# EAGLE design AstroEQ SMD MK2 (EQ5) (EAGLE 6.6.0)
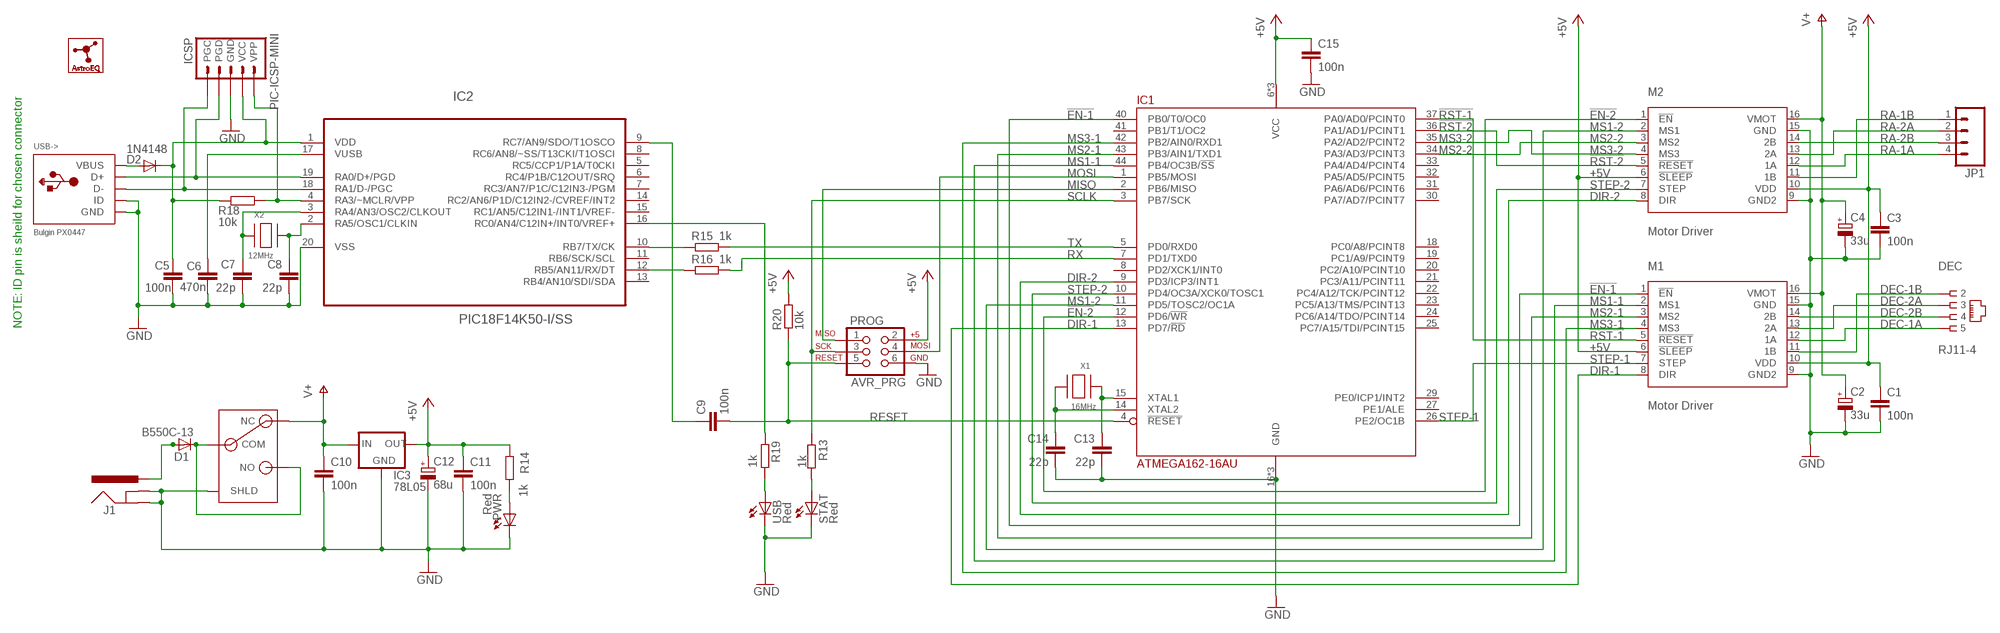
[diagram p0: schematic, sheet 1]

## Parts
C1  100n  C-EUC0603  [C0603]
C2  33u  CPOL-EUC/6032-28R  [C/6032-28R]
C3  100n  C-EUC0603  [C0603]
C4  33u  CPOL-EUC/6032-28R  [C/6032-28R]
C5  100n  C-EUC0603  [C0603]
C6  470n  C-EUC0603  [C0603]
C7  22p  C-EUC0603  [C0603]
C8  22p  C-EUC0603  [C0603]
C9  100n  C-EUC0603  [C0603]
C10  100n  C-EUC0603  [C0603]
C11  100n  C-EUC0603  [C0603]
C12  68u  CPOL-EUC/6032-28R  [C/6032-28R]
C13  22p  C-EUC0603  [C0603]
C14  22p  C-EUC0603  [C0603]
C15  100n  C-EUC0603  [C0603]
D1  B550C-13  DIODE-SMC  [SMC]
D2  1N4148  DIODESOD  [SOD-323]
DEC  RJ11-4  [RJ11-NO_SHIELD-4]
IC1  ATMEGA162-16AU  [TQFP44]
IC2  PIC18F14K50-I/SS  [SS20]
IC3  78L05  78LXXSOT-23  [SOT23]
ICSP  PIC-ICSP-MINI  [PIC-ICSP-MINI]
J1  POWER_JACKPANEL  [POWER_JACK_PANEL]
JP1  M04POLAR  [MOLEX-1X4]
LOGO1  ASTROEQ5MM  [ASTROEQ-SMALL]
M1  Motor Driver  A4983CARRIER  [DIP16-W]
M2  Motor Driver  A4983CARRIER  [DIP16-W]
PROG  AVR_PRG  AVR_SPI_PRG_6PTH  [2X3]
PWR  Red  LED3MM  [LED3MM]
R13  1k  R-EU_R0603  [R0603]
R14  1k  R-EU_R0603  [R0603]
R15  1k  R-EU_R0603  [R0603]
R16  1k  R-EU_R0603  [R0603]
R18  10k  R-EU_R0603  [R0603]
R19  1k  R-EU_R0603  [R0603]
R20  10k  R-EU_R0603  [R0603]
STAT  Red  LED3MM  [LED3MM]
SW1  SWITCH  [SPST]
USB  Red  LED3MM  [LED3MM]
USB->  Bulgin PX0447  USBBULGIN  [USB-MINIB-BULGIN]
X1  16MHz  XTALNX5032  [NX5032]
X2  12MHz  XTALNX5032  [NX5032]

## Nets
!EN-1: IC1.40(PB0/T0/OC0) M1.1(!EN)
!EN-2: IC1.12(PD6/!WR) M2.1(!EN)
!RST-1: IC1.37(PA0/AD0/PCINT0) M1.5(!RESET)
!RST-2: IC1.36(PA1/AD1/PCINT1) M2.5(!RESET)
+5V: C1.1 C3.1 C11.1 C12.+ C15.1 IC1.6(VCC) IC1.17(VCC) IC1.38(VCC) IC3.1(OUT) M1.6(!SLEEP) M1.10(VDD) M2.6(!SLEEP) M2.10(VDD) PROG.2 R14.1 R20.2
AVROSC1: C13.1 IC1.15(XTAL1) X1.P$1
AVROSC2: C14.1 IC1.14(XTAL2) X1.P$2
D+: IC2.19(RA0/D+/PGD) ICSP.4(PGD) USB->.3(D+)
D-: IC2.18(RA1/D-/PGC) ICSP.5(PGC) USB->.2(D-)
DEC-1A: DEC.5 M1.12(1A)
DEC-1B: DEC.2 M1.11(1B)
DEC-2A: DEC.3 M1.13(2A)
DEC-2B: DEC.4 M1.14(2B)
DIR-1: IC1.13(PD7/!RD) M1.8(DIR)
DIR-2: IC1.9(PD3/ICP3/INT1) M2.8(DIR)
DTR: C9.1 IC2.9(RC7/AN9/SDO/T1OSCO)
GND: C1.2 C2.- C3.2 C4.- C5.2 C6.1 C7.2 C8.2 C10.2 C11.2 C12.- C13.2 C14.2 C15.2 IC1.16(GND) IC1.28(GND) IC1.39(GND) IC2.20(VSS) IC3.3(GND) ICSP.3(GND) J1.SHUNT(GNDBREAK) J1.SLEEVE(GND) M1.9(GND2) M1.15(GND) M2.9(GND2) M2.15(GND) PROG.6 PWR.K(C) STAT.K(C) SW1.S1(SHLD) SW1.S2(SHLD) SW1.S3(SHLD) SW1.S4(SHLD) USB->.4(GND) USB->.5(ID) USB.K(C)
MCLR: IC2.4(RA3/~MCLR/VPP) ICSP.1(VPP) R18.1
MISO: IC1.2(PB6/MISO) PROG.1
MOSI: IC1.1(PB5/MOSI) PROG.4
MS1-1: IC1.44(PB4/OC3B/!SS) M1.2(MS1)
MS1-2: IC1.11(PD5/TOSC2/OC1A) M2.2(MS1)
MS2-1: IC1.43(PB3/AIN1/TXD1) M1.3(MS2)
MS2-2: IC1.34(PA3/AD3/PCINT3) M2.3(MS2)
MS3-1: IC1.42(PB2/AIN0/RXD1) M1.4(MS3)
MS3-2: IC1.35(PA2/AD2/PCINT2) M2.4(MS3)
PWRLED: PWR.A R14.2
RA-1A: JP1.4 M2.12(1A)
RA-1B: JP1.1 M2.11(1B)
RA-2A: JP1.2 M2.13(2A)
RA-2B: JP1.3 M2.14(2B)
RESET: C9.2 IC1.4(!RESET) PROG.5 R20.1
RX: IC1.7(PD1/TXD0) R16.1
RX(USB): IC2.12(RB5/AN11/RX/DT) R16.2
SCLK: IC1.3(PB7/SCK) PROG.3 R13.1
STATLED: R13.2 STAT.A
STEP-1: IC1.26(PE2/OC1B) M1.7(STEP)
STEP-2: IC1.10(PD4/OC3A/XCK0/TOSC1) M2.7(STEP)
SWITCH: D1.C SW1.COM SW1.NO
TX: IC1.5(PD0/RXD0) R15.1
TX(USB): IC2.10(RB7/TX/CK) R15.2
USBLED: R19.1 USB.A
USBOSC1: C8.1 IC2.2(RA5/OSC1/CLKIN) X2.P$2
USBOSC2: C7.1 IC2.3(RA4/AN3/OSC2/CLKOUT) X2.P$1
USBSTAT: IC2.16(RC0/AN4/C12IN+/INT0/VREF+) R19.2
V+: C2.+ C4.+ C10.1 IC3.2(IN) M1.16(VMOT) M2.16(VMOT) SW1.NC
VBUS: D2.2(A) USB->.1(VBUS)
VIN: D1.A J1.CENTRE(PWR)
VPIC: C5.1 D2.1(C) IC2.1(VDD) ICSP.2(VCC) R18.2
VUSB: C6.2 IC2.17(VUSB)
Unconnected: IC1.8(PD2/XCK1/INT0) IC1.18(PC0/A8/PCINT8) IC1.19(PC1/A9/PCINT9) IC1.20(PC2/A10/PCINT10) IC1.21(PC3/A11/PCINT11) IC1.22(PC4/A12/TCK/PCINT12) IC1.23(PC5/A13/TMS/PCINT13) IC1.24(PC6/A14/TDO/PCINT14) IC1.25(PC7/A15/TDI/PCINT15) IC1.27(PE1/ALE) IC1.29(PE0/ICP1/INT2) IC1.30(PA7/AD7/PCINT7) IC1.31(PA6/AD6/PCINT6) IC1.32(PA5/AD5/PCINT5) IC1.33(PA4/AD4/PCINT4) IC1.41(PB1/T1/OC2) IC2.5(RC5/CCP1/P1A/T0CKI) IC2.6(RC4/P1B/C12OUT/SRQ) IC2.7(RC3/AN7/P1C/C12IN3-/PGM) IC2.8(RC6/AN8/~SS/T13CKI/T1OSCI) IC2.11(RB6/SCK/SCL) IC2.13(RB4/AN10/SDI/SDA) IC2.14(RC2/AN6/P1D/C12IN2-/CVREF/INT2) IC2.15(RC1/AN5/C12IN1-/INT1/VREF-)

## Notes on the sheet
- NOTE: ID pin is sheild for chosen connector

## Library data of the parts
C1 C3 C5 C9-C11 C15 = resistor:C-EU: CAPACITOR, European symbol; MF: MULTICOMP; MPN: T0603F104ZCT; OC_FARNELL: 9406204
C2 C4 = resistor:CPOL-EU: POLARIZED CAPACITOR, European symbol; MF: KEMET; MPN: T491C336K025AT; OC_FARNELL: 1793896
C6 = rcl:C-EU: CAPACITOR, European symbol; MF: MURATA; MPN: GRM188R61C474KA93D; OC_FARNELL: 1828894
C7 C8 C13 C14 = rcl:C-EU: CAPACITOR, European symbol; MF: MULTICOMP; MPN: U0603C220JCT; OC_FARNELL: 9406107
C12 = resistor:CPOL-EU: POLARIZED CAPACITOR, European symbol; MF: AVX; MPN: TPSC686K016R0125; OC_FARNELL: 1658976
D1 = diode:DIODE-: DIODE; MF: DIODES INC.; MPN: B550C-13-F; OC_FARNELL: 1858608
D2 = SparkFun:DIODE: Diode These are standard reverse protection diodes and small signal diodes. SMA package can handle up to about 1A. SOD-323 can handle about 200mA. What the SOD-323 package when ordering, there are some mfgs out there that are 5-pin packages.; MF: VISHAY SEMICONDUCTOR; MPN: 1N4148WS-V-GS08; OC_FARNELL: 1617737
DEC = con-tycoelectronics:RJ11-4; MF: MOLEX; MPN: 95503-2641; OC_FARNELL: 1572017
IC1 = atmel:ATMEGA162: 8-bit RISC MICROCONTROLLER 16K Bytes internal flash program memory 1K Bytes internal SRAM Upto 64K Bytes optional external memory space 512 Bytes EEPROM Two 8-bit timers Two 16-bit timers Dual programmable serial USARTs Master/Slave serial SPI interface Source: ATMEGA162_DIP40.lbr; MF: ATMEL; MPN: ATMEGA162-16AU; OC_FARNELL: 9171150
IC2 = microchip:PIC18F14K50: USB Flash Microcontrollers; MF: MICROCHIP; MPN: PIC18F14K50-I/SS; OC_FARNELL: 1648504; PACKAGE: SSOP20; SUPPLIER: Microchip
IC3 = v-reg:78LXX: VOLTAGE REGULATOR; MF: TAIWAN SEMICONDUCTOR; MPN: TS78L05CX RF; OC_FARNELL: 1476698
ICSP = SparkFun:PIC-ICSP-MINI: PIC-ICSP-Mini Miniature 5-pin connection for temporary programming of PICs. Use this device in your design to save space. Program the PIC with this adapter Spark Fun Electronics SKU : BOB-00194; MF: HARWIN; MPN: M52-5000545; OC_FARNELL: 1099543
J1 = SparkFun:POWER_JACK: Power Jack This is the standard 5.5mm barrel jack for power. The PTH is the most common, proven, reliable, footprint. All others are experimental. The Slot footprint only works if the mill layer is transmitted to the PCB fab house so be warned. Spark Fun Electronics SKU : PRT-00119. Mating wall wart : TOL-00298 (and others); MF: SWITCHCRAFT; MPN: PCL712AS; OC_FARNELL: 1871167
JP1 = SparkFun:M04: Header 4 Standard 4-pin 0.1" header. Use with straight break away headers (SKU : PRT-00116), right angle break away headers (PRT-00553), swiss pins (PRT-00743), machine pins (PRT-00117), and female headers (PRT-00115). Molex polarized connector foot print use with SKU : PRT-08231 with associated crimp pins and housings. 1MM SMD Version SKU: PRT-10208; MF: MULTICOMP; MPN: MC34645; OC_FARNELL: 1675775
LOGO1 = AstroEQTooth:ASTROEQ
M1 M2 = A4983Carrier:A4983CARRIER; OC_FARNELL: unknown
PROG = SparkFun:AVR_SPI_PRG_6: AVR ISP 6 Pin This is the reduced ISP connector for AVR programming. Common on Arduino. This footprint will take up less PCB space and can be used with a 10-pin to 6-pin adapter such as SKU: BOB-08508; MF: TE CONNECTIVITY / AMP; MPN: 826632-3; OC_FARNELL: 3418492
PWR STAT USB = led:LED: LED OSRAM: - CHIPLED LG R971, LG N971, LY N971, LG Q971, LY Q971, LO R971, LY R971 LH N974, LH R974 LS Q976, LO Q976, LY Q976 LO Q996 - Hyper CHIPLED LW Q18S LB Q993, LB Q99A, LB R99A - SideLED LS A670, LO A670, LY A670, LG A670, LP A670 LB A673, LV A673, LT A673, LW A673 LH A674 LY A675 LS A676, LA A676, LO A676, LY A676, LW A676 LS A679, LY A679, LG A679 - Hyper Micro SIDELED® LS Y876, LA Y876, LO Y876, LY Y876 LT Y87S - SmartLED LW L88C, LW L88S LB L89C, LB L89S, LG L890 LS L89K, LO L89K, LY L89K LS L896, LA L896, LO L896, LY L896 - TOPLED LS T670, LO T670, LY T670, LG T670, LP T670 LSG T670, LSP T670, LSY T670, LOP T670, LYG T670 LG T671, LOG T671, LSG T671 LB T673, LV T673, LT T673, LW T673 LH T674 LS T676, LA T676, LO T676, LY T676, LB T676, LH T676, LSB T676, LW T676 LB T67C, LV T67C, LT T67C, LS T67K, LO T67K, LY T67K, LW E67C LS E67B, LA E67B, LO E67B, LY E67B, LB E67C, LV E67C, LT E67C LW T67C LS T679, LY T679, LG T679 LS T770, LO T770, LY T770, LG T770, LP T770 LB T773, LV T773, LT T773, LW T773 LH T774 LS E675, LA E675, LY E675, LS T675 LS T776, LA T776, LO T776, LY T776, LB T776 LHGB T686 LT T68C, LB T68C - Hyper Mini TOPLED® LB M676 - Mini TOPLED Santana® LG M470 LS M47K, LO M47K, LY M47K Source: http://www.osram.convergy.de LUXEON: - LUMILED® LXK2-PW12-R00, LXK2-PW12-S00, LXK2-PW14-U00, LXK2-PW14-V00 LXK2-PM12-R00, LXK2-PM12-S00, LXK2-PM14-U00 LXK2-PE12-Q00, LXK2-PE12-R00, LXK2-PE12-S00, LXK2-PE14-T00, LXK2-PE14-U00 LXK2-PB12-K00, LXK2-PB12-L00, LXK2-PB12-M00, LXK2-PB14-N00, LXK2-PB14-P00, LXK2-PB14-Q00 LXK2-PR12-L00, LXK2-PR12-M00, LXK2-PR14-Q00, LXK2-PR14-R00 LXK2-PD12-Q00, LXK2-PD12-R00, LXK2-PD12-S00 LXK2-PH12-R00, LXK2-PH12-S00 LXK2-PL12-P00, LXK2-PL12-Q00, LXK2-PL12-R00 Source: www.luxeon.com KINGBRIGHT: KA-3528ASYC Source: www.kingbright.com; MF: KINGBRIGHT; MPN: L-424HDT; OC_FARNELL: 1142499
R13 R14 R19 = rcl:R-EU_: RESISTOR, European symbol; MF: PANASONIC; MPN: ERJ3GEYJ102V; OC_FARNELL: 2059601
R15 R16 = SmartPrj:R-EU_: RESISTOR, European symbol; MF: PANASONIC; MPN: ERJ3GEYJ102V; OC_FARNELL: 2059601
R18 R20 = rcl:R-EU_: RESISTOR, European symbol; MF: PANASONIC; MPN: ERJ3GEYJ103V; OC_FARNELL: 2059627
SW1 = con-tycoelectronics:SWITCH; MF: TE CONNECTIVITY; MPN: AE101J1V3B004; OC_FARNELL: 1813654
USB-> = adafruit:USB: USB Connectors USBMINIB - Surface Mount Female Mini-B USB Connector 4UConnector: 06564 By microbuilder.eu Thru-hole RA Female Mini-B USB Connector 4UConnector: 18732 By ladyada.net; MF: BULGIN; MPN: PX0447; OC_FARNELL: 1229687
X1 = adafruit:XTAL: Low cost SMT crystals, no capacitors included http://www.ladyada.net/library/eagle; MF: TXC; MPN: 7A-16.000MAAJ-T; OC_FARNELL: 1841946
X2 = adafruit:XTAL: Low cost SMT crystals, no capacitors included http://www.ladyada.net/library/eagle; MF: TXC; MPN: 7A-12.000MAAJ-T; OC_FARNELL: 1841940

## Net classes
1 power: width 0.61 mm, drill 0.711 mm, clearance 0.203 mm
2 gnd: width 0.305 mm, drill 0.711 mm, clearance 0.203 mm
3 usbvcc: width 0.508 mm, drill 0.711 mm, clearance 0.203 mm

## Board
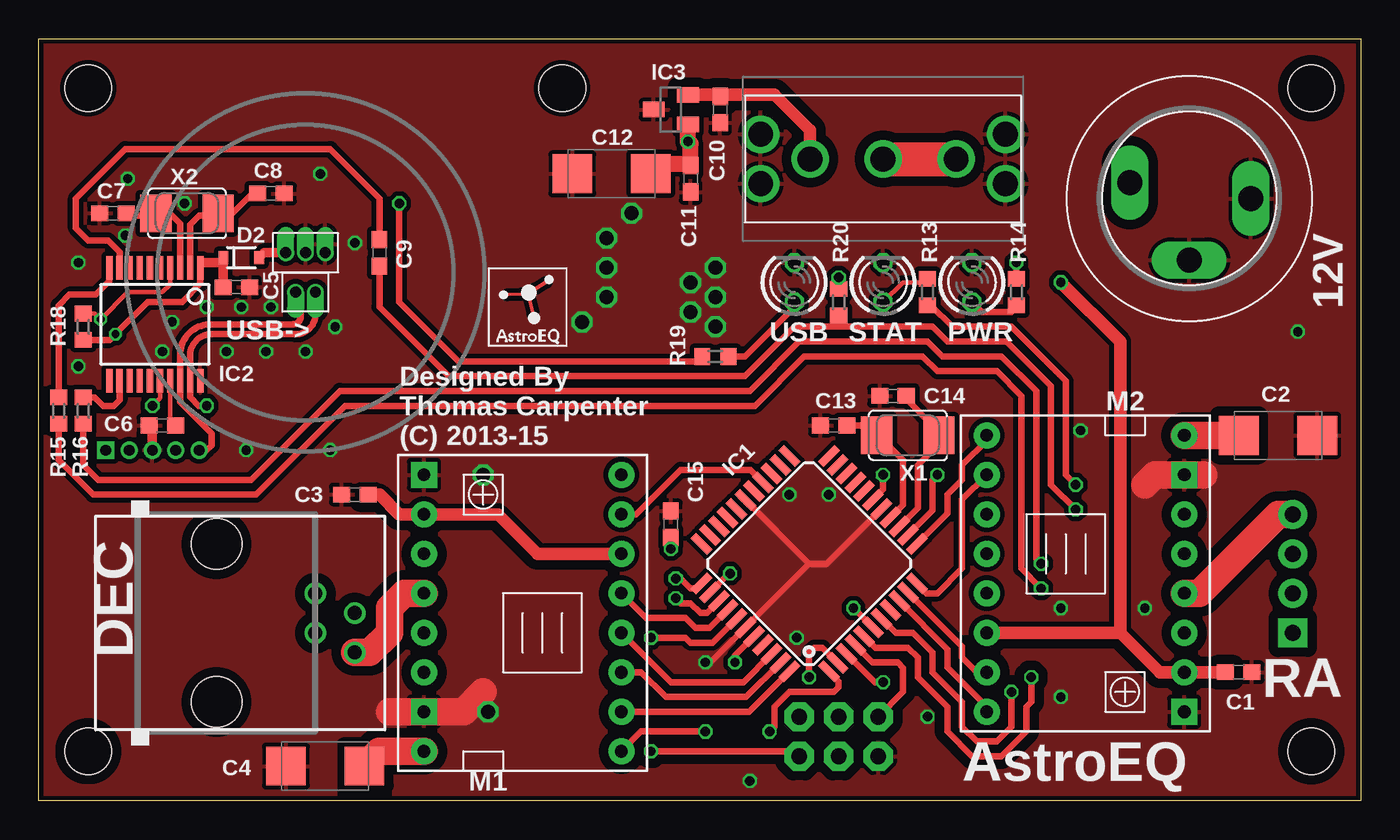
[diagram p1: board, top side]
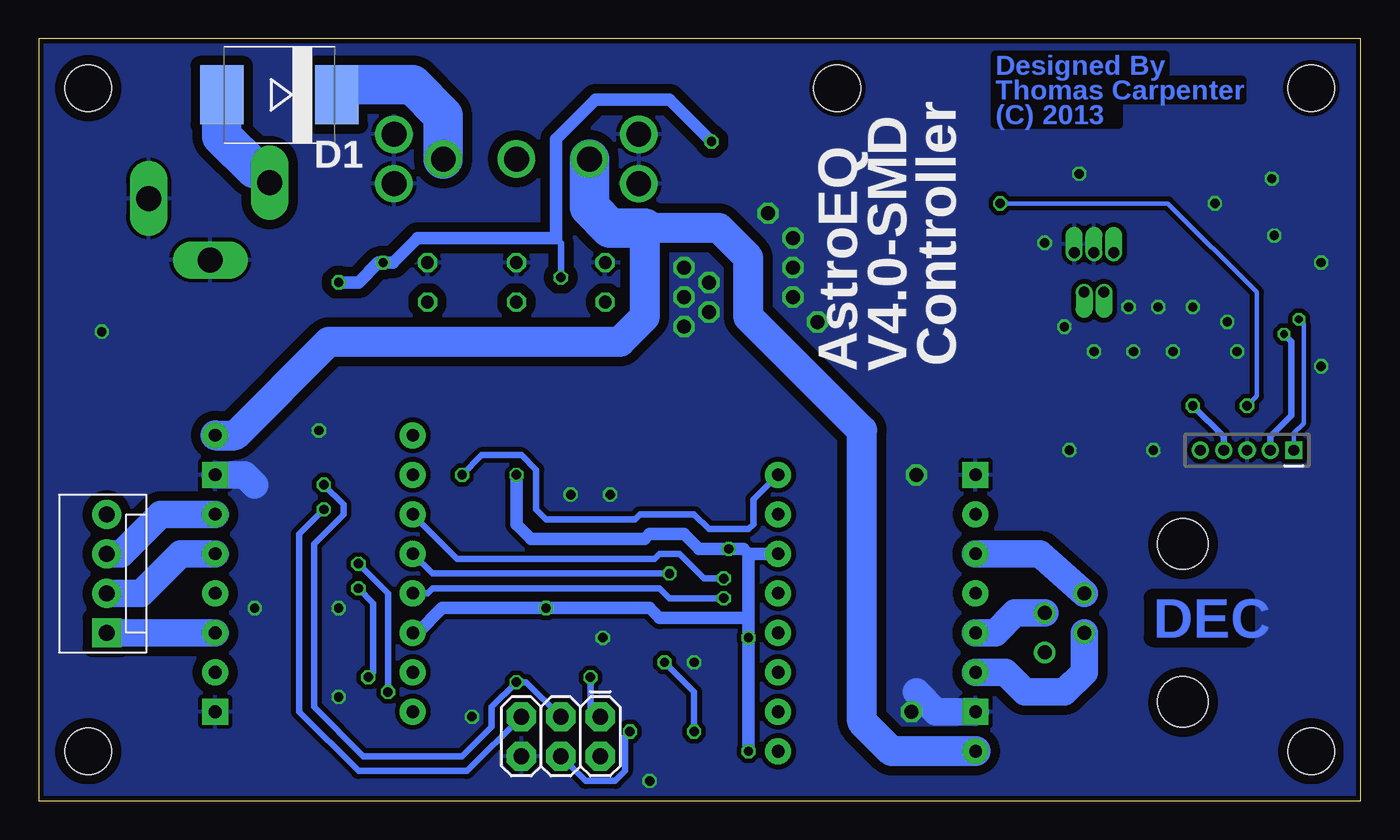
[diagram p2: board, bottom side, seen from below]

Size 85 x 49 mm. Coordinates in mm from the lower left corner, seen from the top.
Outline: 0,0 0,49 85,49 85,0 0,0
Copper layers (1*16): Top 0.035mm / dielectric 1.5mm / Bottom 0.035mm
Design rules "default": minimum track width 6mil, minimum drill 12mil, track to track 6mil, track to pad 6mil, pad to pad 6mil, via to via 6mil, smd to smd 0mil, copper to edge 10mil, drill to drill 10mil, minimum pad ring 8mil, minimum via ring 6mil, stop-mask expansion 2mil, vias tented up to drill 1mm, thermal gap 10mil
Holes 3 mm at 81.83,3.17 33.66,45.83 3.17,45.83 81.83,45.83 3.17,3.17
tKeepout: area 78.3,7.4 to 83.3,12.4; area 78.3,53.6 to 83.3,58.6; area 48.3,7.4 to 53.3,12.4; area 8.3,7.4 to 13.3,12.4; area 48.3,53.6 to 53.3,58.6; area 8.3,53.6 to 13.3,58.6
bKeepout: area 78.3,7.4 to 83.3,12.4; area 78.3,53.6 to 83.3,58.6; area 48.3,7.4 to 53.3,12.4; area 8.3,7.4 to 13.3,12.4; area 48.3,53.6 to 53.3,58.6; area 8.3,53.6 to 13.3,58.6

### Footprints (pad centres in the part's own frame; a part is rotated, then mirrored left to right if it is on the bottom)
C0603 = smd 1.1 x 1: 1 -0.85,0; 2 0.85,0
C/6032-28R = smd 2.55 x 2.5: + 2.525,0; - -2.525,0
SMC = smd 2.8 x 3.8: A 3.7,0; C -3.7,0
SOD-323 = smd 0.63 x 0.83: 1 -1.15,0; 2 1.15,0
RJ11-NO_SHIELD-4 = drill 0.9 pad 1.4: 2 -1.905,6.35; 3 -0.635,8.89; 4 0.635,6.35; 5 1.905,8.89 | hole 3.251: -5.08,0; 5.08,0
TQFP44 = smd 1.5 x 0.5: 1 -5.8,4; 2 -5.8,3.2; 3 -5.8,2.4; 4 -5.8,1.6; 5 -5.8,0.8; 6 -5.8,0; 7 -5.8,-0.8; 8 -5.8,-1.6; 9 -5.8,-2.4; 10 -5.8,-3.2; 11 -5.8,-4; 23 5.8,-4; 24 5.8,-3.2; 25 5.8,-2.4; 26 5.8,-1.6; 27 5.8,-0.8; 28 5.8,0; 29 5.8,0.8; 30 5.8,1.6; 31 5.8,2.4; 32 5.8,3.2; 33 5.8,4 | smd 0.5 x 1.5: 12 -4,-5.8; 13 -3.2,-5.8; 14 -2.4,-5.8; 15 -1.6,-5.8; 16 -0.8,-5.8; 17 0,-5.8; 18 0.8,-5.8; 19 1.6,-5.8; 20 2.4,-5.8; 21 3.2,-5.8; 22 4,-5.8; 34 4,5.8; 35 3.2,5.8; 36 2.4,5.8; 37 1.6,5.8; 38 0.8,5.8; 39 0,5.8; 40 -0.8,5.8; 41 -1.6,5.8; 42 -2.4,5.8; 43 -3.2,5.8; 44 -4,5.8
SS20 = smd 0.4 x 1.5: 1 -2.925,-3.625; 2 -2.275,-3.625; 3 -1.625,-3.625; 4 -0.975,-3.625; 5 -0.325,-3.625; 6 0.325,-3.625; 7 0.975,-3.625; 8 1.625,-3.625; 9 2.275,-3.625; 10 2.925,-3.625; 11 2.925,3.625; 12 2.275,3.625; 13 1.625,3.625; 14 0.975,3.625; 15 0.325,3.625; 16 -0.325,3.625; 17 -0.975,3.625; 18 -1.625,3.625; 19 -2.275,3.625; 20 -2.925,3.625
SOT23 = smd 1 x 1.4: 1 -0.95,-1.1; 2 0.95,-1.1; 3 0,1.1
PIC-ICSP-MINI = drill 0.7 square: 1 -3,0 | drill 0.7: 2 -1.5,0; 3 0,0; 4 1.5,0; 5 3,0
POWER_JACK_PANEL = drill 1.6 long: CENTRE 3.81,-1.016; SHUNT -3.962,0; SLEEVE 0,3.962
MOLEX-1X4 = drill 1.016 pad 1.88 square: 1 0,0 | drill 1.016 pad 1.88: 2 2.54,0; 3 5.08,0; 4 7.62,0
DIP16-W = drill 0.813 pad 1.676: 1 -8.89,-6.35; 2 -6.35,-6.35; 3 -3.81,-6.35; 4 -1.27,-6.35; 5 1.27,-6.35; 6 3.81,-6.35; 7 6.35,-6.35; 8 8.89,-6.35; 10 6.35,6.35; 11 3.81,6.35; 12 1.27,6.35; 13 -1.27,6.35; 14 -3.81,6.35; 16 -8.89,6.35 | drill 0.813 pad 1.676 square: 9 8.89,6.35; 15 -6.35,6.35
2X3 = drill 1.016 pad 1.88 octagon: 1 0,0; 2 0,2.54; 3 2.54,0; 4 2.54,2.54; 5 5.08,0; 6 5.08,2.54
LED3MM = drill 0.813 octagon: A -1.27,0; K 1.27,0
R0603 = smd 1 x 1.1: 1 -0.85,0; 2 0.85,0
SPST = drill 1.6: COM 0,0; NC -4.699,0; NO 4.699,0; S1 7.874,1.587; S2 7.874,-1.587; S3 -7.874,1.587; S4 -7.874,-1.587
USB-MINIB-BULGIN = drill 0.7 pad 1.016 offset: 1 -1.27,1.27; 2 -0.635,-1.27; 3 0.635,-1.27; 4 0,1.27; 5 1.27,1.27
NX5032 = smd 2 x 2.4: P$1 2,0; P$2 -2,0

### Placement (x,y rotation side)
C1  77.15,8.26 0 top
C2  79.69,23.5 180 top
C3  20.32,19.68 180 top
C4  18.41,2.22 0 top
C5  12.7,33.02 0 top
C6  7.94,24.13 0 top
C7  4.76,37.78 180 top
C8  14.92,39.05 0 top
C9  21.91,35.24 270 top
C10  43.81,44.45 270 top
C11  41.91,40.01 270 top
C12  36.83,40.32 0 top
C13  51.12,24.13 180 top
C14  54.93,26.04 180 top
C15  40.64,17.78 90 top
D1  69.53,45.4 180 bottom
D2  13.02,34.92 0 top
DEC  11.43,11.43 270 top
IC1  49.53,15.24 135 top
IC2  7.46,30.64 180 top
IC3  40.64,44.45 90 top
ICSP  7.3,22.54 180 bottom
J1  73.98,38.73 180 top
JP1  80.64,10.79 90 bottom
LOGO1  28.89,29.21 0 top
M1  31.11,12.06 90 top
M2  67.31,14.61 270 top
PROG  48.9,5.4 180 bottom
PWR  60.01,33.34 90 top
R13  57.15,32.7 90 top
R14  62.87,32.7 270 top
R15  1.27,25.08 90 top
R16  2.86,25.08 90 top
R18  2.86,30.48 270 top
R19  43.5,28.57 180 top
R20  51.44,32.07 90 top
STAT  54.29,33.34 90 top
SW1  54.29,41.27 0 top
USB  48.58,33.34 90 top
USB->  17.14,33.97 0 top
X1  55.88,23.5 180 top
X2  9.53,37.78 180 top

### Tracks (layer width: path | path; a pad name or v marks a point on that pad's centre or on a via)
!EN-1  (via drill 0.6)
  Top 0.406: IC1.40 44.77,9.35 v44.77,8.89 | M1.1 38.73,4.45 v42.86,4.45
  Bottom 0.406: v44.77,8.89 42.86,6.99 v42.86,4.45
!EN-2
  Top 0.406: IC1.12 58.42,18.47 58.42,19.68 59.37,20.64 59.37,21.59 60.96,23.18 M2.1
!RST-1
  Top 0.406: IC1.37 43.14,11.11 42.23,11.11 41.59,11.75 39.05,11.75 M1.5
!RST-2  (via drill 0.6)
  Top 0.406: IC1.36 42.96,12.06 42.55,12.06 41.91,12.7 41.27,12.7 v40.96,13.02
  Bottom 0.406: v40.96,13.02 44.45,13.02 45.09,13.65 59.69,13.65 60.01,13.34 M2.5
+5V  (via drill 0.6)
  Top 0.406: IC1.38 43.32,10.16 41.91,10.16 41.59,10.48 v39.37,10.48 | IC1.6 v52.39,12.38 | PROG.2 48.58,3.17 v39.37,3.17 | IC1.17 54.29,20 v54.29,20.95 | R20.2 v51.44,33.66 | R14.1 v62.87,34.61
  Top 0.813: C3.1 21.91,19.68 23.18,18.41 M1.10 29.53,18.41 32.07,15.88 M1.6 | 69.53,10.79 72.07,8.26 M2.10 C1.1 | 69.53,10.79 M2.6 | 69.53,10.79 69.53,29.53 v65.72,33.34 | C15.1 v40.64,16.19
  Top 1.016: IC3.1 v41.74,42.4 41.91,42.23 41.91,40.96 | C12.+ 39.66,40.32 40.3,40.96 41.91,40.96 | C11.1 41.91,40.96
  Bottom 0.406: 51.75,36.2 51.44,35.88 v51.44,33.66
  Bottom 0.813: 39.37,11.75 45.09,11.75 45.72,12.38 v52.39,12.38 59.05,12.38 60.64,10.79 M2.6 | v39.37,3.17 v39.37,10.48 39.37,11.75 | M1.6 39.37,15.88 | 39.37,15.88 39.37,11.75 | v54.29,20.95 54.29,17.78 53.34,16.83 46.04,16.83 45.72,17.14 43.5,17.14 42.55,16.19 v40.64,16.19 39.69,16.19 39.37,15.88 | v65.72,33.34 64.45,33.34 63.18,34.61 v62.87,34.61 62.23,34.61 60.64,36.2 51.75,36.2 51.75,42.55 49.21,45.09 44.45,45.09 41.91,42.55 v41.74,42.4
AVROSC1
  Top 0.406: IC1.15 55.56,19.01 55.56,21.91 53.98,23.5 X1.P$1 53.24,24.13 C13.1
AVROSC2
  Top 0.406: IC1.14 56.52,18.83 56.52,21.59 57.78,22.86 X1.P$2 57.68,23.69 57.68,23.91 55.78,25.82 C14.1
D+  (via drill 0.6)
  Top 0.406: USB->.3 17.78,31.27 arc-90 16.51,30 10.95,30 arc90 9.74,28.47 IC2.19 9.74,25.95 10.29,25.4 v10.79,25.4
  Bottom 0.406: ICSP.4 8.8,23.41 v10.79,25.4
D-
  Top 0.406: USB->.2 arc-90 16.83,32.38 16.83,31.11 arc-90 16.35,30.64 10.95,30.64 arc90 9.09,28.61 IC2.18 9.09,25.65 11.11,23.62 11.11,22.86 10.79,22.54 ICSP.5
DEC-1A
  Top 1.778: DEC.5 21.27,9.53 22.54,10.79 22.54,12.38 23.5,13.34 M1.12
DEC-1B
  Bottom 1.778: M1.11 20.64,15.88 DEC.2
DEC-2A
  Bottom 1.778: DEC.3 22.23,12.06 23.5,10.79 M1.13
DEC-2B
  Bottom 1.778: M1.14 22.86,8.26 21.59,6.99 19.05,6.99 17.78,8.26 DEC.4
DIR-1  (via drill 0.6)
  Top 0.406: IC1.13 57.47,18.65 57.47,20.64 v57.78,20.95
  Bottom 0.406: M1.8 39.05,19.37 39.05,17.78 39.37,17.46 41.91,17.46 42.86,18.41 46.35,18.41 46.67,18.1 52.39,18.1 53.02,18.73 53.02,21.27 53.98,22.23 56.52,22.23 v57.78,20.95
DIR-2
  Top 0.406: IC1.9 58.42,9.74 58.42,8.57 60.96,6.03 M2.8
DTR
  Top 0.406: IC2.9 5.19,35.3 4.45,36.04 3.17,36.04 2.38,36.83 2.38,38.73 5.56,41.91 18.73,41.91 21.91,38.73 C9.1
GND  (via drill 0.6, 0.9)
  Top 0.406: 43.18,8.89 IC1.39 49.53,15.24 | IC1.16 50.66,15.24 49.53,15.24 | IC1.28 49.53,15.24 | 49.53,15.24
  Top 0.61: C6.1 7.3,23.91 ICSP.3
  Top 1.778: 28.57,6.99 27.3,5.71 M1.15 22.54,5.71 | 71.12,20.32 71.75,20.95 M2.15 74.93,20.95
  Bottom 1.778: M1.15 27.3,5.71 28.57,6.99 | M2.15 71.75,20.95 71.12,20.32
  other vias: 71.12,12.38 57.15,5.4 42.86,8.89 48.26,19.68 20.32,35.88 80.96,30.16 18.1,40.32 65.72,12.38 50.8,19.68 18.73,22.54 7.94,28.89 66.99,23.81 14.61,28.89 48.74,10.48 5.71,40.01 19.05,30.48 17.14,28.89 13.02,31.75 8.57,30.8 14.92,31.75 10.79,31.75 9.37,38.42 12.06,28.89 5.56,36.35 13.34,22.54 2.54,34.61 2.54,27.94 45.72,1.27 65.72,6.67 43.5,34.29 41.91,33.34 41.91,31.43 36.51,34.29 36.51,32.38 34.92,30.8 28.57,20.95 28.89,5.71 36.51,36.2 38.1,37.78 43.5,32.38 43.5,30.48
  pour Top (isolate 0.61, rank 3): 30.16,50.16 85.79,50.16 85.79,-0.95 -2.54,-0.95 -2.54,19.68 30.16,19.68
  pour Bottom (isolate 0.61): 30.16,49.85 85.79,49.85 85.79,-1.27 -2.54,-1.27 -2.54,19.68 15.56,19.68 16.19,20.32 30.16,20.32
  pour Top (isolate 0.305): -2.54,50.8 -2.54,-1.59 0.95,-1.59 0.95,18.73 14.61,18.73 15.56,19.68 21.91,19.68 23.18,18.41 29.53,18.41 32.07,15.88 37.47,15.88 37.47,3.17 44.77,3.17 46.99,5.4 53.66,5.4 59.05,10.79 65.41,10.79 67.94,8.26 73.66,8.26 73.66,8.89 73.34,8.89 70.48,11.75 70.48,32.7 65.09,37.78 43.81,37.78 43.81,43.81 40.32,43.81 40.32,48.26 83.5,48.26 84.14,48.26 84.14,-2.22 87.31,-2.22 87.31,48.26 87.31,50.8
  pour Bottom (isolate 0.305): -2.54,50.8 -2.54,-2.22 0.95,-2.22 0.95,18.73 14.61,18.73 16.19,20.32 30.16,20.32 30.16,38.42 36.51,44.77 36.51,48.26 84.14,48.26 84.14,-2.22 87.31,-2.22 87.31,50.8
  pour Bottom (isolate 0.305): 35.24,23.5 35.24,0.95 0.95,0.95 0.95,-2.22 84.14,-2.22 84.14,0.95 70.48,0.95 70.48,21.91 63.5,21.91 63.5,25.4 61.28,27.62 39.37,27.62
  pour Top (isolate 0.305, rank 2): 0.95,-2.22 0.95,0.95 13.34,0.95 13.34,4.13 19.05,4.13 19.05,0.32 22.86,0.32 22.86,0.64 45.09,0.64 45.09,1.91 46.67,1.91 46.67,0.64 85.72,0.64 85.72,-2.22
MCLR  (via drill 0.5)
  Top 0.305: IC2.4 8.44,33.2 7.94,32.7 5.71,32.7 v3.97,30.96 3.6,31.33 R18.1
  Bottom 0.305: v3.97,30.96 3.67,30.66 3.67,24.27 4.3,23.64 ICSP.1
MISO  (via drill 0.6)
  Top 0.406: IC1.2 50.4,9.84 49.85,9.84 49.53,9.53 v49.53,7.94
  Bottom 0.406: PROG.1 49.53,6.03 v49.53,7.94
MOSI  (via drill 0.6)
  Top 0.406: IC1.1 51.44,7.68 51.44,7.3 51.12,6.99 48.26,6.99 47.31,6.03 47.31,4.76 v46.99,4.45
  Bottom 0.406: v46.99,4.45 47.31,4.13 47.31,1.91 47.94,1.27 49.85,1.27 PROG.4
MS1-1
  Top 0.406: IC1.44 45.66,5.71 M1.2
MS1-2
  Top 0.406: IC1.11 57.09,13.34 57.78,13.34 59.37,14.92 59.37,19.37 M2.2
MS2-1
  Top 0.406: M1.3 38.73,8.26 40.32,6.67 45.48,6.67 IC1.43
MS2-2  (via drill 0.6)
  Top 0.406: IC1.34 42.29,13.65 41.91,13.65 41.27,14.29 v40.96,14.29
  Bottom 0.406: M2.3 58.1,15.56 45.4,15.56 45.09,15.88 43.81,15.88 42.23,14.29 v40.96,14.29
MS3-1
  Top 0.406: M1.4 40.64,7.62 45.3,7.62 IC1.42
MS3-2  (via drill 0.6)
  Top 0.406: IC1.35 44.37,14.61 v44.45,14.61
  Bottom 0.406: v44.45,14.61 59.69,14.61 M2.4
PWRLED
  Top 0.406: PWR.A 60.64,31.43 62.55,31.43 62.87,31.75 R14.2
RA-1A
  Top 1.778: M2.12 74.61,13.34 79.69,18.41 JP1.4
RA-1B
  Bottom 1.778: JP1.1 M2.11
RA-2A
  Bottom 1.778: M2.13 75.88,15.88 78.42,13.34 JP1.2
RA-2B
  Bottom 1.778: M2.14 77.15,18.41 79.69,15.88 JP1.3
RESET  (via drill 0.6)
  Top 0.406: IC1.4 53.62,8.89 55.24,8.89 55.56,8.53 55.56,6.99 PROG.5 | v66.67,18.73 65.09,20.32 65.09,26.67 62.23,29.53 58.42,29.53 57.47,30.48 51.44,30.48 | 51.44,30.48 48.58,30.48 45.4,27.3 26.35,27.3 21.91,31.75 C9.2 | R20.1 51.44,30.48
  Bottom 0.406: v66.67,18.73 68.26,17.14 68.26,5.71 64.45,1.91 57.47,1.91 PROG.5
RX  (via drill 0.6)
  Top 0.406: R16.1 2.86,21.59 3.81,20.64 13.65,20.64 19.37,26.35 45.72,26.35 48.9,29.53 57.15,29.53 58.1,28.57 61.91,28.57 64.14,26.35 64.14,15.56 v64.45,15.24 | IC1.7 55.11,10.79 56.2,10.79 57.47,9.53 57.47,8.26 59.37,6.35 59.37,4.76 60.33,3.81 61.59,3.81 62.55,4.76 v62.55,6.99
  Bottom 0.406: v62.55,6.99 62.55,13.34 v64.45,15.24
RX(USB)
  Top 0.406: IC2.12 5.19,25.77 4.82,25.4 4.13,25.4 3.6,25.93 R16.2
SCLK  (via drill 0.6)
  Top 0.406: IC1.3 53.76,7.62 v54.29,7.62 | v66.67,20.32 66.04,20.95 66.04,26.99 62.55,30.48 58.74,30.48 57.37,31.85 R13.1
  Bottom 0.406: PROG.3 53.66,7.62 v54.29,7.62 55.88,6.03 55.88,4.76 57.78,2.86 64.14,2.86 67.31,6.03 67.31,16.51 65.41,18.41 65.41,19.05 v66.67,20.32
STATLED
  Top 0.305: R13.2 57.15,33.34 55.56,33.34 STAT.A
STEP-1
  Top 0.406: M1.7 38.42,18.41 41.27,21.27 45.76,21.27 IC1.26
STEP-2
  Top 0.406: IC1.10 59.37,9.92 59.37,9.21 60.33,8.26 M2.7
SWITCH
  Top 2.184: SW1.COM SW1.NO
  Bottom 2.184: D1.C 65.2,46.04 65.09,46.04
  Bottom 2.54: 65.09,46.04 60.96,46.04 58.99,44.07 SW1.NO
TX  (via drill 0.6)
  Top 0.406: R15.1 1.27,21.91 3.49,19.68 13.97,19.68 19.68,25.4 46.04,25.4 49.21,28.57 56.83,28.57 57.78,27.62 61.59,27.62 63.18,26.04 63.18,14.92 v64.45,13.65 | IC1.5 53.8,9.84 55.88,9.84 56.52,9.21 56.52,7.94 58.42,6.03 58.42,4.45 60.01,2.86 61.91,2.86 63.5,4.45 63.5,6.03 63.82,6.35 v63.82,7.94
  Bottom 0.406: v63.82,7.94 63.5,8.26 63.5,12.7 v64.45,13.65
TX(USB)
  Top 0.406: IC2.10 4.54,33.43 3.65,32.54 1.96,32.54 1.27,31.85 R15.2
USBLED
  Top 0.406: R19.1 45.4,28.57 48.58,31.75 USB.A
USBOSC1
  Top 0.406: IC2.2 9.74,37.04 10.32,37.62 11.53,37.62 | 11.53,37.62 12.3,37.62 13.73,39.05 C8.1 | X2.P$2 11.53,37.62
USBOSC2
  Top 0.406: IC2.3 9.09,37.11 8.57,37.62 7.53,37.62 | 7.53,37.62 5.77,37.62 C7.1 | X2.P$1 7.53,37.62
USBSTAT  (via drill 0.6)
  Top 0.305: IC2.16 7.79,25.88 v7.3,25.4
  Top 0.406: v23.18,38.42 23.18,32.07 26.99,28.26 42.33,28.26 R19.2
  Bottom 0.305: v7.3,25.4 6.67,26.04 6.67,32.7 12.38,38.42 v23.18,38.42
V+
  Top 0.813: SW1.NC 49.59,43.12 47.31,45.4 43.81,45.4 | 43.81,45.4 IC3.2 | C10.1 43.81,45.4
  Top 1.778: C4.+ 21.89,3.17 M1.16 | C2.+ M2.16
  Bottom 1.93: M1.16 30.16,3.17 32.07,5.08 32.07,23.81 39.37,31.11 39.37,34.92 41.27,36.83 46.04,36.83 46.04,31.11 47.62,29.53 66.36,29.53 72.39,23.5 M2.16
  Bottom 2.54: 46.04,36.83 48.26,36.83 49.59,38.16 SW1.NC
VBUS
  Top 0.61: USB->.1 14.48,35.24 D2.2
VIN
  Bottom 2.184: 71.12,40.64 71.06,40.64 J1.CENTRE
  Bottom 2.54: D1.A 73.23,42.75 71.12,40.64
VPIC  (via drill 0.5)
  Top 0.305: IC2.1 10.39,34.77 10.55,34.61
  Top 0.406: IC2.1 10.39,33.25 9.21,32.07 6.99,32.07 v4.92,30 4.55,29.63 R18.2
  Top 0.61: 10.55,34.61 11.75,34.61 11.87,34.73 D2.1 11.85,34.61 C5.1
  Bottom 0.406: v4.92,30 4.45,29.53 4.45,24.77 5.8,23.41 ICSP.2
VUSB
  Top 0.305: IC2.17 8.44,24.48 C6.2

### Text on the board
Bottom: Designed By | Thomas Carpenter | (C) 2013 | DEC
tNames: 12V | Designed By | Thomas Carpenter | (C) 2013-15 | RA | AstroEQ
bNames: Controller | V4.0-SMD | AstroEQ
Reference: This board design is for AstroEQ boards which fit inside the enclosure on an EQ5 Mount. | The board uses some very tricky surface mount components and is not recommended for DIY. | It is a 2 Layer board designed to be sent for manufacture. The AstroEQ-SMD-Gerber.zip file contains the required gerber files. | I use iteadstudio.com 10cm x 5cm prototype service, selecting 1.2mm thick, HASL, 100% electrical check